# Altium schematic sheet E17-15-CHARGE_SW.SchDoc
size A; DocumentNumber: 4; SheetNumber: 4; SheetTotal: 9
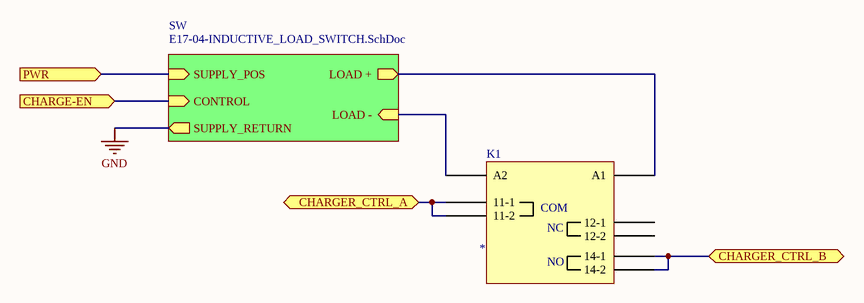
[diagram p0: E17-15-CHARGE_SW.SchDoc]

## Parts
K1  *  [TE-7-1393243-5]

## Sub-sheets
SW = E17-04-INDUCTIVE_LOAD_SWITCH.SchDoc: CONTROL (in), LOAD + (out), SUPPLY_POS (in), LOAD - (in), SUPPLY_RETURN (out)

## Ports
CHARGE-EN (in), CHARGER_CTRL_A (bidir), CHARGER_CTRL_B (bidir), PWR (in)

## Nets
GND: sheet SW/SUPPLY_RETURN
CHARGE-EN: port CHARGE-EN, sheet SW/CONTROL
CHARGER_CTRL_A: K1.3(11-1) K1.6(11-2) ; port CHARGER_CTRL_A
CHARGER_CTRL_B: K1.4(14-1) K1.5(14-2) ; port CHARGER_CTRL_B
PWR: port PWR, sheet SW/SUPPLY_POS
NetK1_1: K1.1(A2) ; sheet SW/LOAD -
NetK1_8: K1.8(A1) ; sheet SW/LOAD +

Not connected (* = marked no-connect by the designer): K1 2(12-1) 7(12-2)

## Notes on the sheet
- (in symbol TE-1393240-3) COM; NC; NO

## Library data of the parts
K1 = TE-1393240-3: RELAY GEN PURPOSE SPDT 16A 110V